# EasyEDA schematic EasyEDA_SCH_smart-led.json
TITLE: Smart LED; REV: 1.0; Date: 2026-08-20; Sheet: 1/1; Drawn By: Denis Komarkov; Company: komarkov.com
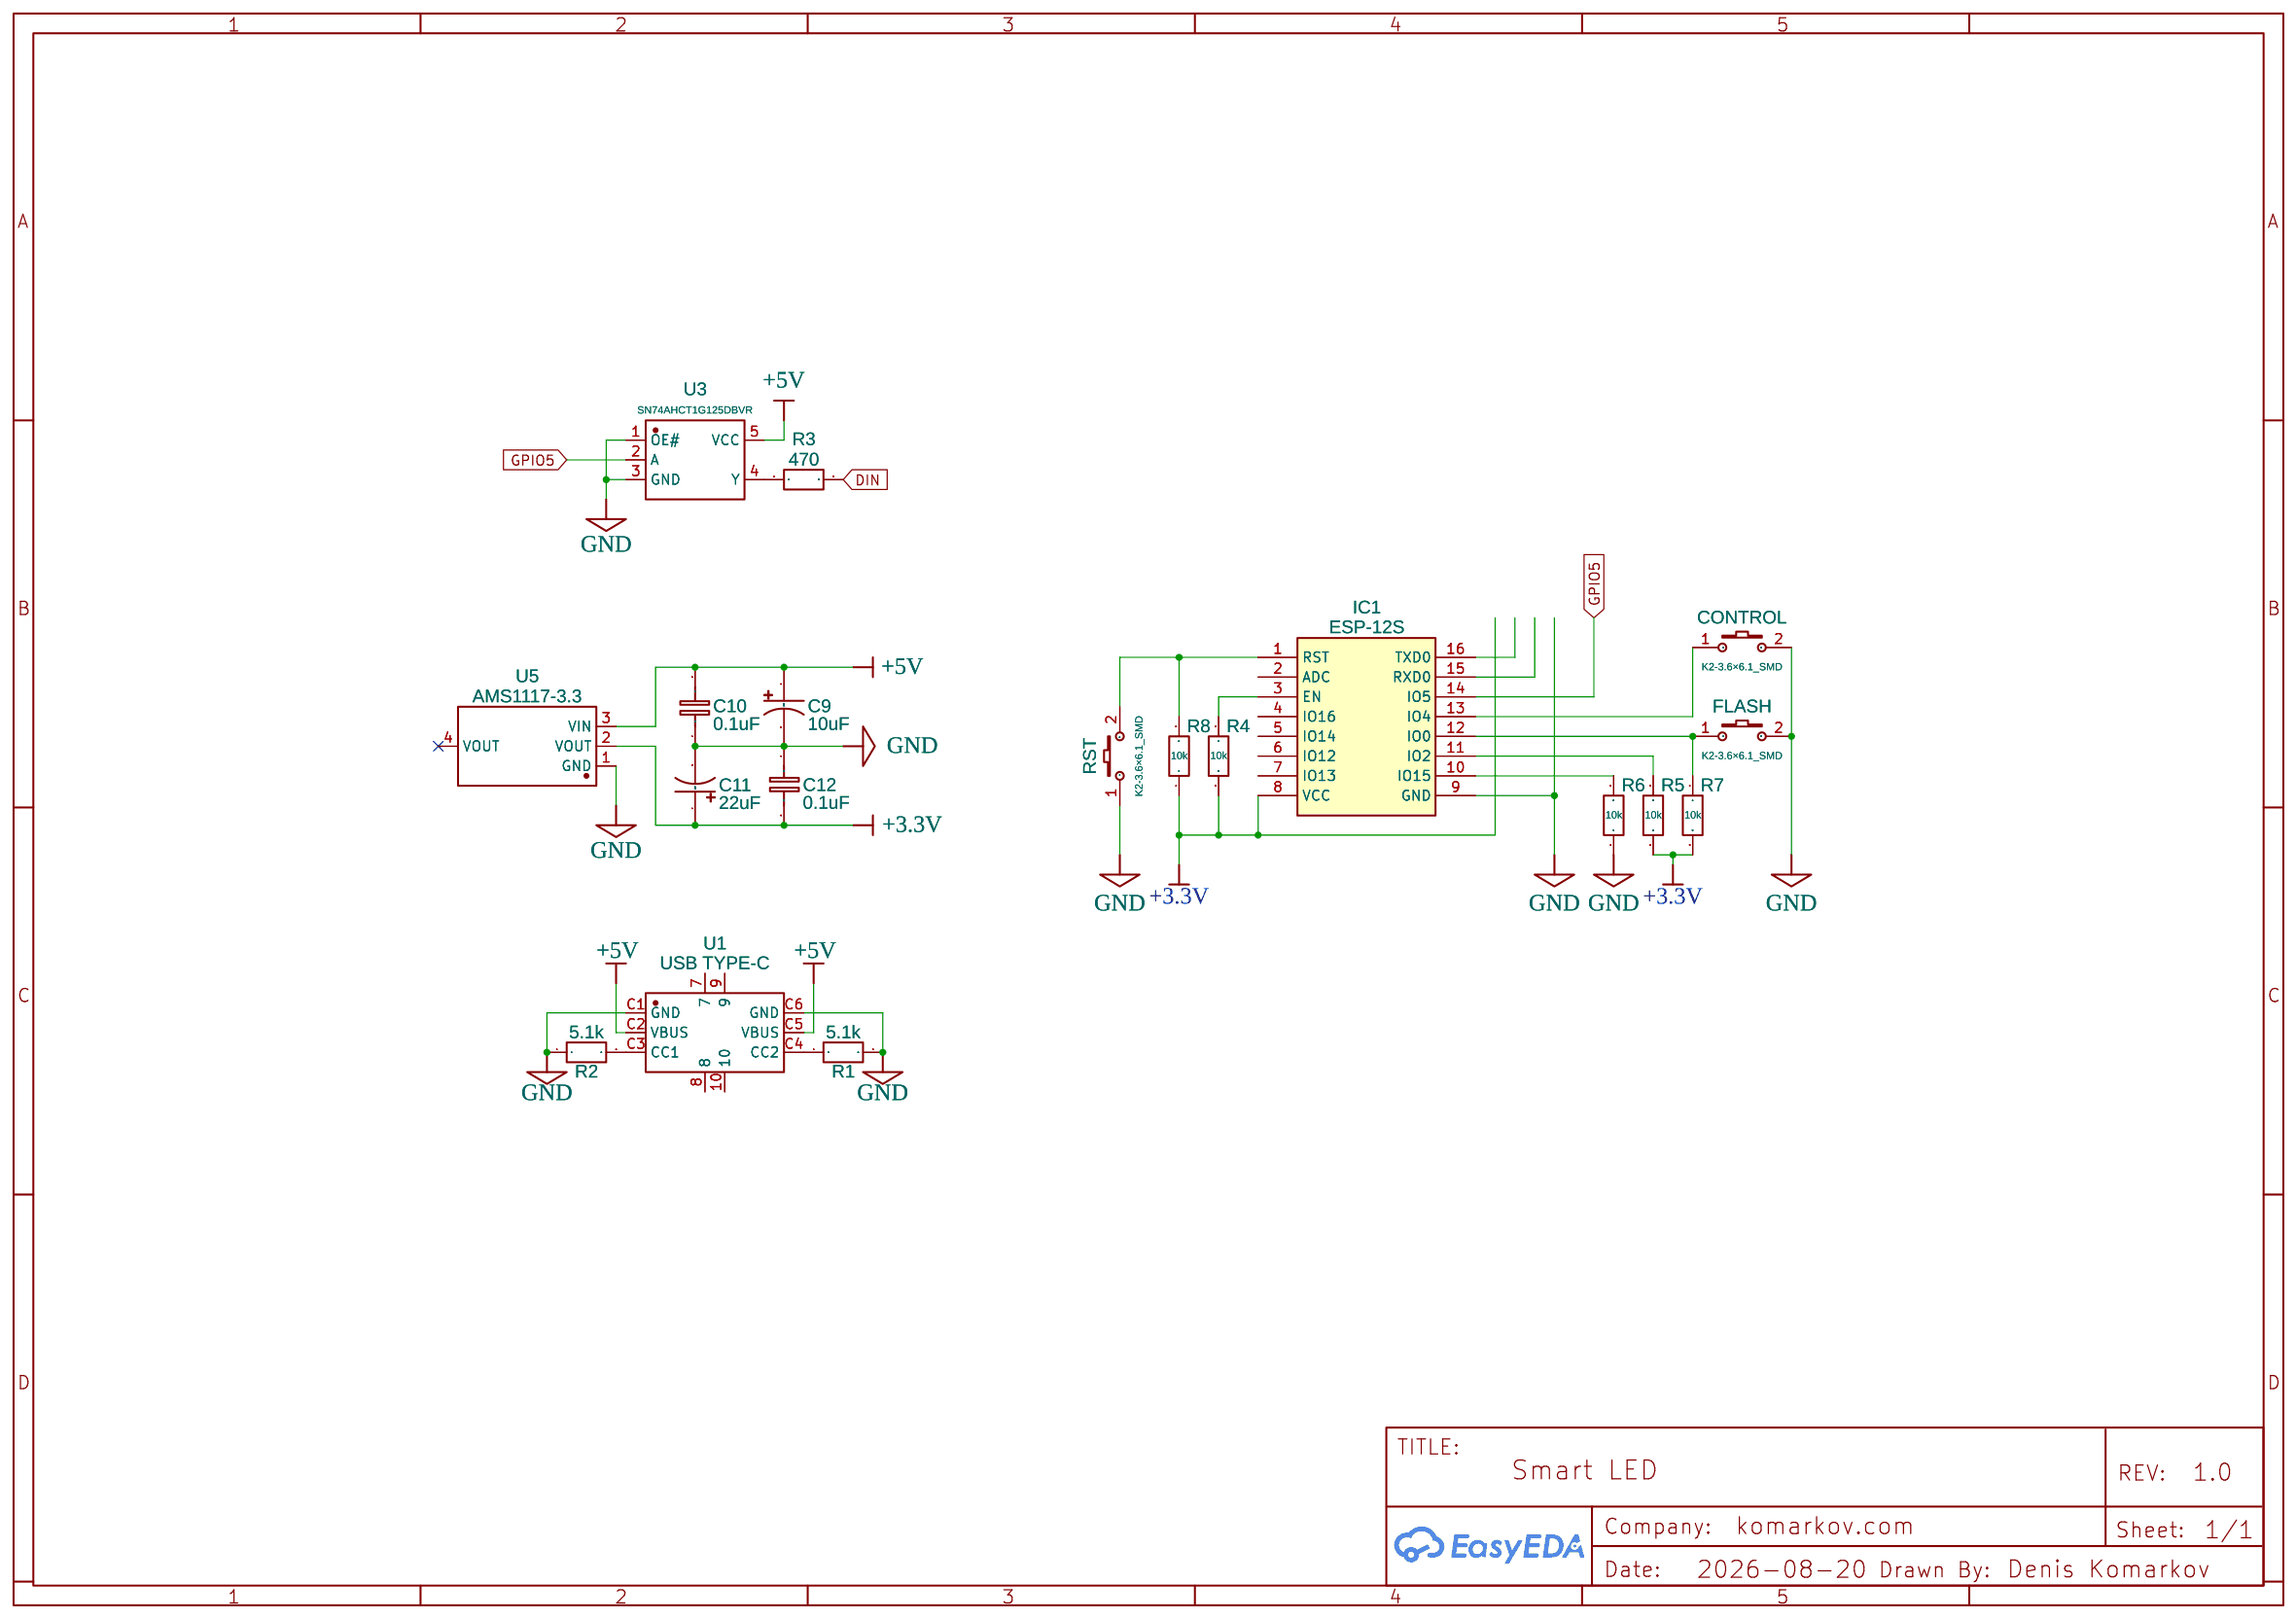
[diagram p0: schematic sheet]

## Parts
C9  10uF  [CAP-SMD_BD4.0-L4.3-W4.3-FD]
C10  0.1uF  [C0805]
C11  22uF  [CAP-SMD_BD5.0-L5.3-W5.3-FD]
C12  0.1uF  [C0805]
CONTROL  K2-3.6×6.1_SMD  [KEY-SMD_2P-L6.2-W3.6-LS8.0]
FLASH  K2-3.6×6.1_SMD  [KEY-SMD_2P-L6.2-W3.6-LS8.0]
IC1  ESP-12S  [ESP12S]
R1  5.1k  [R1206]
R2  5.1k  [R1206]
R3  470  [R1206]
R4  10k  [R0805]
R5  10k  [R0805]
R6  10k  [R0805]
R7  10k  [R0805]
R8  10k  [R0805]
RST  K2-3.6×6.1_SMD  [KEY-SMD_2P-L6.2-W3.6-LS8.0]
U1  USB TYPE-C  [USB-TYPE-C-SMD_TYPE-C-6P-USB3.1TYPE-C06PF-073]
U3  SN74AHCT1G125DBVR  [SOT-23-5_L3.0-W1.7-P0.95-LS2.8-BR]
U5  AMS1117-3.3  [SOT-223-3_L6.5-W3.4-P2.30-LS7.0-BR]

## Library data of the parts
C9 = EEEFC1C100AR: Contributor: LCSC; Supplier: LCSC; Supplier Part: C401619; Manufacturer: PANASONIC(松下); JLCPCB Part Class: Extended Part
C10 C12 = C_0805_EU: Contributor: LCEDA_Lib
C11 = EEEFC1C220AR: Contributor: LCSC; Supplier: LCSC; Supplier Part: C336306; Manufacturer: PANASONIC(松下); JLCPCB Part Class: Extended Part
CONTROL FLASH RST = K2-3.6×6.1_SMD: Supplier Part: C118141; Supplier: LCSC; Manufacturer Part: K2-1107ST-A4SW-06; Contributor: LCEDA_Lib; 制造商: 韩国韩荣
IC1 = ESP-12S: Datasheet Link: https://www.elecrow.com/download/ESP-12S_User_Manual.pdf; Height: 3mm; Manufacturer_Name: Ai-Thinker; Contributor: tochio
R1-R3 = R_1206_EU: Contributor: LCEDA_Lib
R4-R8 = R_0805_EU: Contributor: LCEDA_Lib
U1 = USB3.1 TYPE-C 06PF-073: Supplier: LCSC; Supplier Part: C9900187208; Manufacturer: null; Contributor: lcsc
U3 = SN74AHCT1G125DBVR: Supplier: LCSC; Manufacturer: TI(德州仪器); Supplier Part: C7484; JLCPCB Part Class: Extended Part
U5 = AMS1117-3.3: Supplier: LCSC; Supplier Part: C6186; Manufacturer: AMS; JLCPCB Part Class: Basic Part; Contributor: Astro Clark

## Nets
+3.3V: C11.1 C12.2 IC1.8(VCC) R4.2 R5.1 R7.2 R8.1 U5.2(VOUT)
+5V: C9.1 C10.2 U1.C2(VBUS) U1.C5(VBUS) U3.5(VCC) U5.3(VIN)
GND: C9.2 C10.1 C11.2 C12.1 CONTROL.2 FLASH.2 IC1.9(GND) R1.2 R2.1 R6.1 RST.1 U1.C1(GND) U1.C6(GND) U3.1(OE#) U3.3(GND) U5.1(GND)
DIN: R3.2
GPIO5: IC1.14(IO5) U3.2(A)
Net-(CONTROL-1): CONTROL.1 IC1.13(IO4)
Net-(FLASH-1): FLASH.1 IC1.12(IO0) R7.1
Net-(IC1-1): IC1.1(RST) R8.2 RST.2
Net-(IC1-3): IC1.3(EN) R4.1
Net-(IC1-10): IC1.10(IO15) R6.2
Net-(IC1-11): IC1.11(IO2) R5.2
Net-(R1-1): R1.1 U1.C4(CC2)
Net-(R2-2): R2.2 U1.C3(CC1)
Net-(R3-1): R3.1 U3.4(Y)

Not connected (* = marked no-connect by the designer): IC1 2(ADC) 4(IO16) 5(IO14) 6(IO12) 7(IO13) 15(RXD0) 16(TXD0); U1 7 8 9 10; U5 4(VOUT)*
